# Altium schematic sheet 1wire-Thermocouple.SchDoc
size A
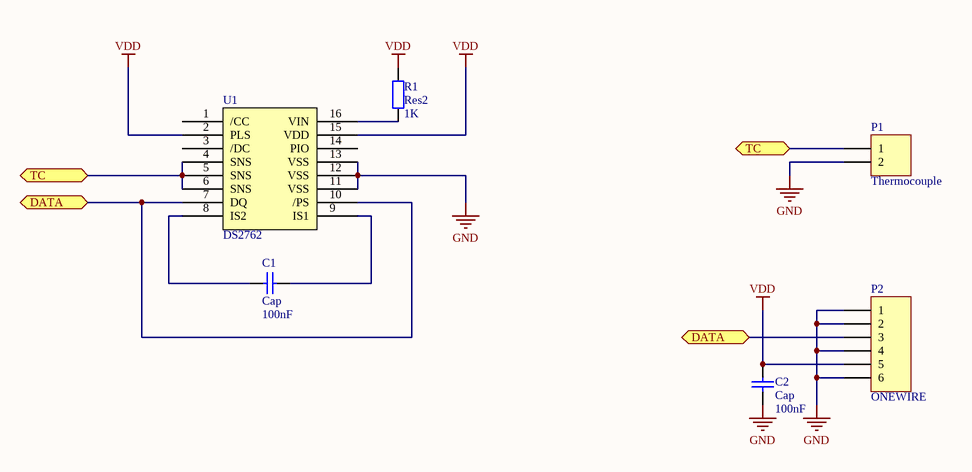
[diagram p0: 1wire-Thermocouple.SchDoc]

## Parts
C1  Cap  value 100nF  [0603]
C2  Cap  value 100nF  [0603]
P1  Thermocouple  [PCC-SMP]
P2  ONEWIRE  [CONN MOD JACK R/A 6P6C]
R1  Res2  value 1K  [0603]
U1  DS2762  [TSSOP-16]

## Ports
DATA, TC

## Nets
GND: C2.2 P1.2 P2.1 P2.2 P2.4 P2.6 U1.11(VSS) U1.12(VSS) U1.13(VSS)
VDD: C2.1 P2.5 R1.1 U1.2(PLS) U1.15(VDD)
DATA: P2.3 U1.7(DQ) U1.10(/PS) ; port DATA
TC: P1.1 U1.4(SNS) U1.5(SNS) U1.6(SNS) ; port TC
NetC1_1: C1.1 U1.9(IS1)
NetC1_2: C1.2 U1.8(IS2)
NetR1_2: R1.2 U1.16(VIN)

Not connected (* = marked no-connect by the designer): U1 1(/CC) 3(/DC) 14(PIO)

## Library data of the parts
C1 C2 = Cap: Capacitor; Supplier 1: Digi-Key; Supplier Part Number 1: 399-1095-1-ND
P1 = Header 2: Header, 2-Pin; LatestRevisionDate: 17-Jul-2002; LatestRevisionNote: Re-released for DXP Platform.; Publisher: Altium Limited
P2 = Header 6: Header, 6-Pin; Supplier Part Number 1: A105007CT-ND; Supplier 1: Digi-Key
R1 = Res2: Resistor; Supplier 1: Digi-Key; Supplier Part Number 1: 311-1.0KGRCT-ND
U1 = DS2762: High-Precision Li+ Battery Monitor With Alerts; Supplier 1: Digi-Key; Supplier Part Number 1: DS2762AE+-ND